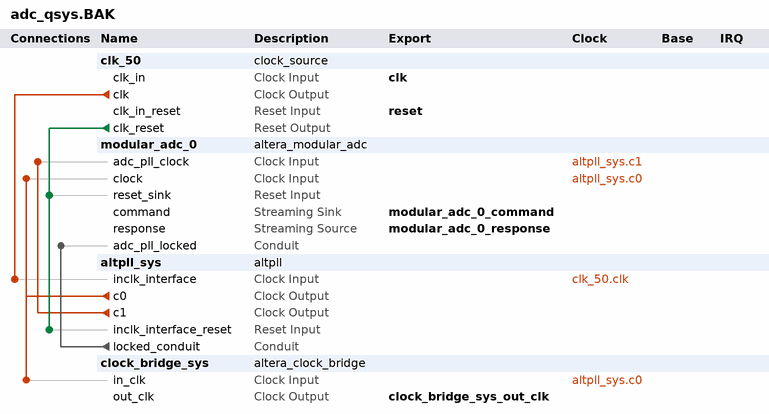
[diagram p0: system contents]
# Platform Designer (Qsys) system adc_qsys.BAK, MAX 10 10M50DAF484C6GES
# Parameters at their usual value, and those the tool derives, are not listed.
package require -exact qsys 17.0
create_system adc_qsys.BAK
set_project_property DEVICE_FAMILY {MAX 10}
set_project_property DEVICE 10M50DAF484C6GES

add_instance clk_50 clock_source 17.0
set_instance_parameter_value clk_50 clockFrequency 50000000

add_instance modular_adc_0 altera_modular_adc 17.0
set_instance_parameter_value modular_adc_0 CLOCK_FREQ 50000000
set_instance_parameter_value modular_adc_0 CORE_VAR 3
set_instance_parameter_value modular_adc_0 DEVICE_PART 10M50DAF484C6GES
set_instance_parameter_value modular_adc_0 clkdiv 2
set_instance_parameter_value modular_adc_0 int_vref_vr 3.0
set_instance_parameter_value modular_adc_0 ip_is_for_which_adc 2
set_instance_parameter_value modular_adc_0 refsel 0
set_instance_parameter_value modular_adc_0 sample_rate 0
set_instance_parameter_value modular_adc_0 seq_order_length 8
set_instance_parameter_value modular_adc_0 seq_order_slot_1 1
set_instance_parameter_value modular_adc_0 seq_order_slot_2 2
set_instance_parameter_value modular_adc_0 seq_order_slot_3 3
set_instance_parameter_value modular_adc_0 seq_order_slot_4 4
set_instance_parameter_value modular_adc_0 seq_order_slot_5 5
set_instance_parameter_value modular_adc_0 seq_order_slot_6 6
set_instance_parameter_value modular_adc_0 seq_order_slot_7 7
set_instance_parameter_value modular_adc_0 seq_order_slot_8 8
set_instance_parameter_value modular_adc_0 use_ch0 false
set_instance_parameter_value modular_adc_0 use_ch1 false
set_instance_parameter_value modular_adc_0 use_ch10 true
set_instance_parameter_value modular_adc_0 use_ch11 true
set_instance_parameter_value modular_adc_0 use_ch12 true
set_instance_parameter_value modular_adc_0 use_ch13 true
set_instance_parameter_value modular_adc_0 use_ch14 true
set_instance_parameter_value modular_adc_0 use_ch15 true
set_instance_parameter_value modular_adc_0 use_ch16 true
set_instance_parameter_value modular_adc_0 use_ch2 false
set_instance_parameter_value modular_adc_0 use_ch3 false
set_instance_parameter_value modular_adc_0 use_ch4 false
set_instance_parameter_value modular_adc_0 use_ch5 true
set_instance_parameter_value modular_adc_0 use_ch6 true
set_instance_parameter_value modular_adc_0 use_ch7 false
set_instance_parameter_value modular_adc_0 use_ch8 false
set_instance_parameter_value modular_adc_0 use_ch9 true
set_instance_parameter_value modular_adc_0 use_tsd true

add_instance altpll_sys altpll 17.0
set_instance_parameter_value altpll_sys CLK0_DIVIDE_BY 1
set_instance_parameter_value altpll_sys CLK0_MULTIPLY_BY 1
set_instance_parameter_value altpll_sys CLK1_DIVIDE_BY 5
set_instance_parameter_value altpll_sys CLK1_DUTY_CYCLE 50
set_instance_parameter_value altpll_sys CLK1_MULTIPLY_BY 1
set_instance_parameter_value altpll_sys CLK1_PHASE_SHIFT 0
set_instance_parameter_value altpll_sys INCLK0_INPUT_FREQUENCY 20000
set_instance_parameter_value altpll_sys PORT_ARESET PORT_USED
set_instance_parameter_value altpll_sys PORT_LOCKED PORT_USED
set_instance_parameter_value altpll_sys PORT_clk1 PORT_USED
set_instance_parameter_value altpll_sys PORT_clk2 PORT_UNUSED
set_instance_parameter_value altpll_sys PORT_clk3 PORT_UNUSED

add_instance clock_bridge_sys altera_clock_bridge 17.0
set_instance_parameter_value clock_bridge_sys DERIVED_CLOCK_RATE 50000000
set_instance_parameter_value clock_bridge_sys EXPLICIT_CLOCK_RATE 0

# connections
add_connection altpll_sys.c0 clock_bridge_sys.in_clk clock
add_connection altpll_sys.c0 modular_adc_0.clock clock
add_connection altpll_sys.c1 modular_adc_0.adc_pll_clock clock
add_connection clk_50.clk altpll_sys.inclk_interface clock
add_connection clk_50.clk_reset altpll_sys.inclk_interface_reset reset
add_connection clk_50.clk_reset modular_adc_0.reset_sink reset
add_connection altpll_sys.locked_conduit modular_adc_0.adc_pll_locked conduit

# exported interfaces
add_interface clk clock sink
set_interface_property clk EXPORT_OF clk_50.clk_in
add_interface clock_bridge_sys_out_clk clock source
set_interface_property clock_bridge_sys_out_clk EXPORT_OF clock_bridge_sys.out_clk
add_interface modular_adc_0_command avalon_streaming sink
set_interface_property modular_adc_0_command EXPORT_OF modular_adc_0.command
add_interface modular_adc_0_response avalon_streaming source
set_interface_property modular_adc_0_response EXPORT_OF modular_adc_0.response
add_interface reset reset sink
set_interface_property reset EXPORT_OF clk_50.clk_in_reset

set_interconnect_requirement {$system} qsys_mm.clockCrossingAdapter HANDSHAKE
set_interconnect_requirement {$system} qsys_mm.insertDefaultSlave FALSE
set_interconnect_requirement {$system} qsys_mm.maxAdditionalLatency 1

save_system adc_qsys.BAK.qsys
